# EAGLE design basic-lipo-manager (EAGLE 7.7.0)
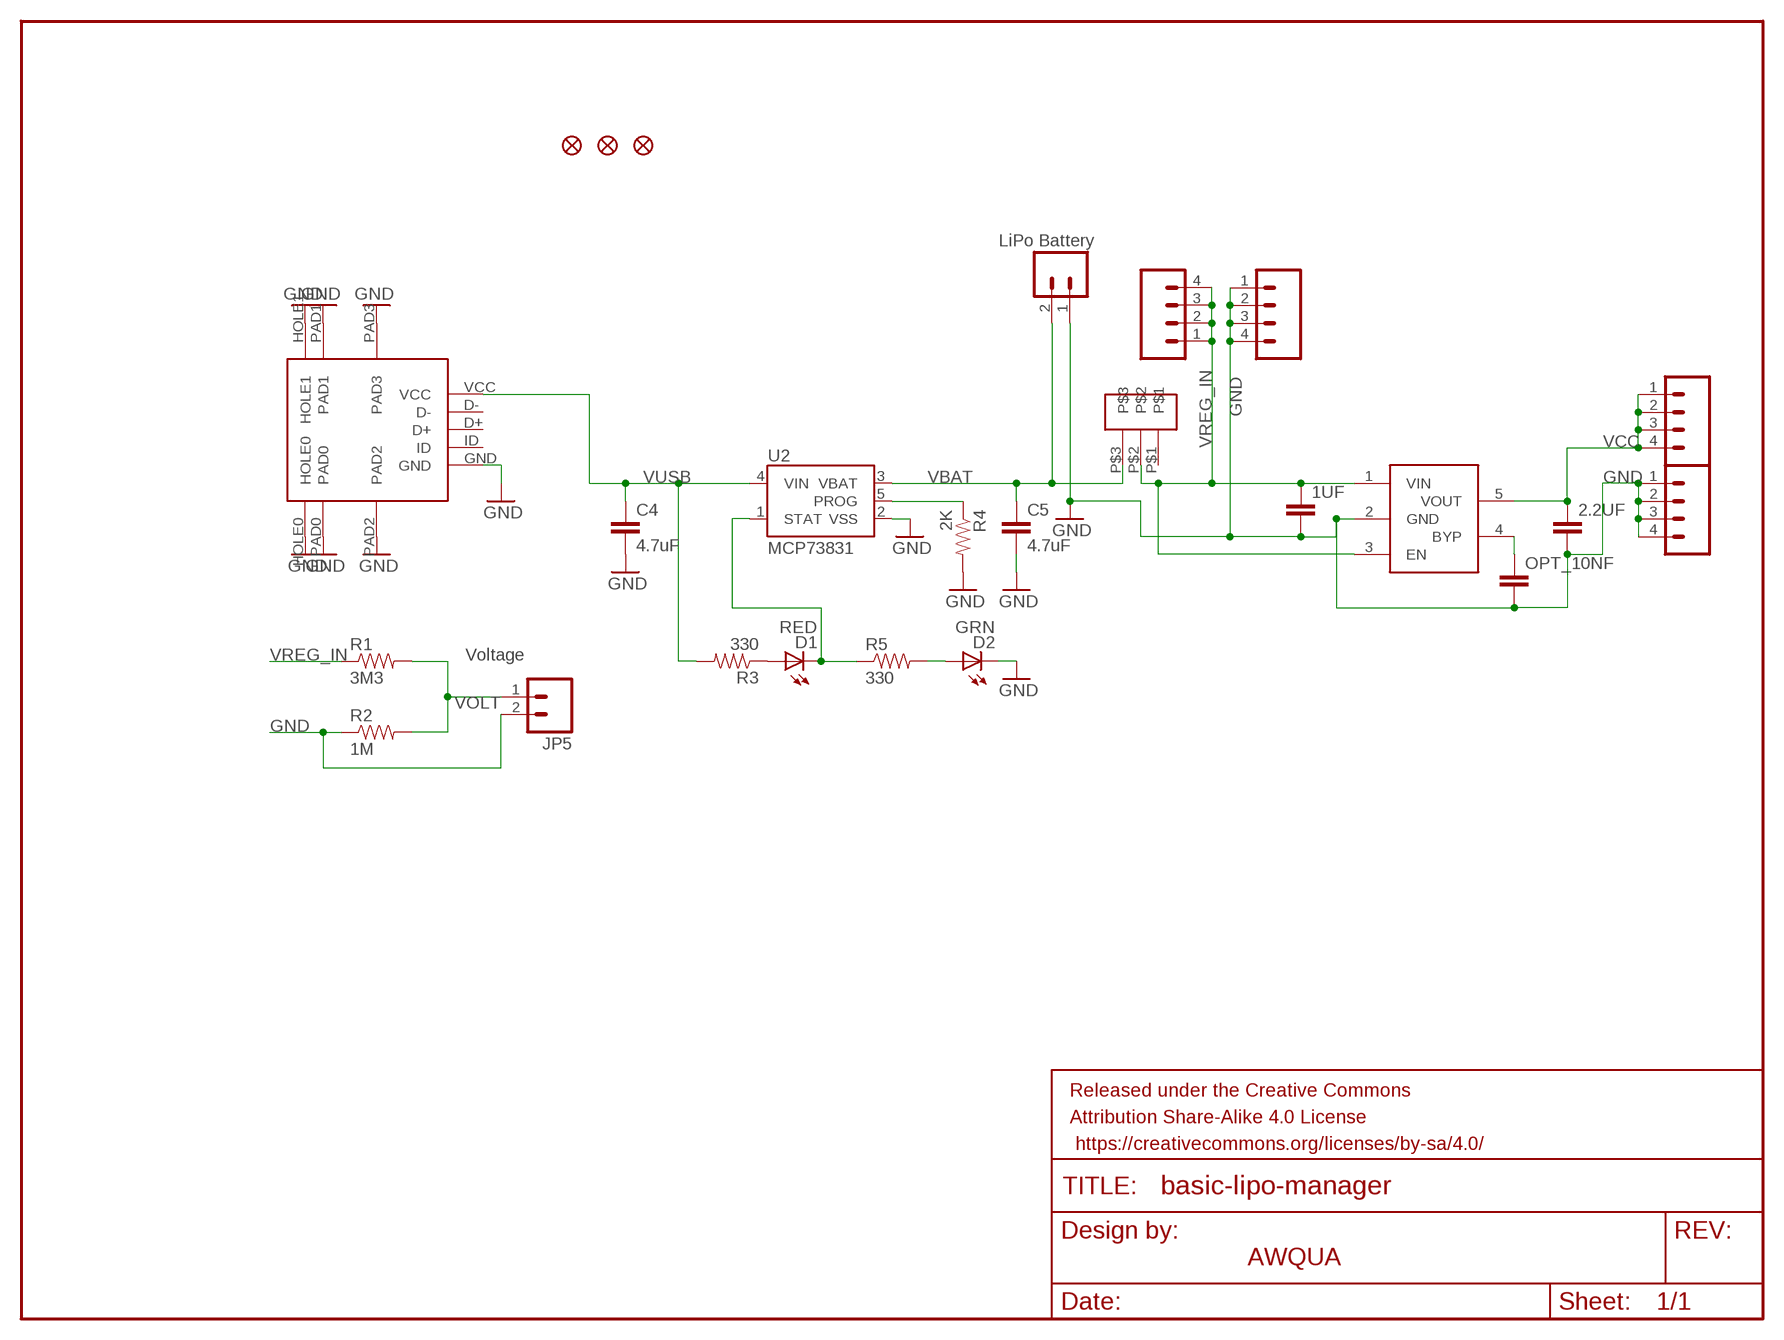
[diagram p0: schematic, sheet 1]

## Parts
1UF  CAP0603-CAP  [0603-CAP]
2.2UF  CAP0603-CAP  [0603-CAP]
C4  4.7uF  CAP0402-CAP  [0402-CAP]
C5  4.7uF  CAP0402-CAP  [0402-CAP]
D1  RED  LED0603  [LED-0603]
D2  GRN  LED0603  [LED-0603]
FID1  FIDUCIAL1X2  [FIDUCIAL-1X2]
FID2  FIDUCIAL1X2  [FIDUCIAL-1X2]
FID3  FIDUCIAL1X2  [FIDUCIAL-1X2]
FRAME1  FRAME-LETTER  [CREATIVE_COMMONS]
JP1  M04PTH  [1X04]
JP2  M04PTH  [1X04]
JP3  M04PTH  [1X04]
JP4  M04PTH  [1X04]
JP5  M02PTH  [1X02]
JP7  LiPo Battery  M02-JST-2MM-SMT  [JST-2-SMD]
OPT_10NF  CAP0603-CAP  [0603-CAP]
R1  3M3  RESISTOR0603  [0603-RES]
R2  1M  RESISTOR0603  [0603-RES]
R3  330  RESISTOR0402-RES  [0402-RES]
R4  2K  RESISTOR0402-RES  [0402-RES]
R5  330  RESISTOR0402-RES  [0402-RES]
U2  MCP73831  [SOT23-5]
U$3  USBMICRO-10118193-0001LF  [USBMICRO-10118193-0001LF]
U$6  LP2985  [LP2985]
U$7  OS102-SPDT-SWITCH  [OS102-SPDT-SWITCH]

## Nets
BYPASS: OPT_10NF.1 U$6.4(BYP)
GND: 1UF.2 2.2UF.2 C4.2 C5.2 D2.C JP2.1 JP2.2 JP2.3 JP2.4 JP4.1 JP4.2 JP4.3 JP4.4 JP5.2 JP7.1 OPT_10NF.2 R2.1 R4.2 U2.2(VSS) U$3.GND U$3.HOLE0 U$3.HOLE1 U$3.PAD0 U$3.PAD1 U$3.PAD2 U$3.PAD3 U$6.2(GND)
N$1: D1.A R3.1
N$5: D2.A R5.2
PROG: R4.1 U2.5(PROG)
STAT: D1.C R5.1 U2.1(STAT)
VBAT: C5.1 JP7.2 U2.3(VBAT) U$7.P$3
VCC: 2.2UF.1 JP3.1 JP3.2 JP3.3 JP3.4 U$6.5(VOUT)
VOLT: JP5.1 R1.2 R2.2
VREG_IN: 1UF.1 JP1.1 JP1.2 JP1.3 JP1.4 R1.1 U$6.1(VIN) U$6.3(EN) U$7.P$2
VUSB: C4.1 R3.2 U2.4(VIN) U$3.VCC
Unconnected: U$3.D+ U$3.D- U$3.ID U$7.P$1

## Notes on the sheet
- Voltage
- AWQUA

## Library data of the parts
1UF 2.2UF OPT_10NF = SparkFun-Passives:CAP: Capacitor Standard 0603 ceramic capacitor, and 0.1" leaded capacitor.
C4 C5 = SparkFun:CAP: Capacitor Standard 0603 ceramic capacitor, and 0.1" leaded capacitor.
D1 D2 = SparkFun:LED: LEDs Standard schematic elements and footprints for 5mm, 3mm, 1206, and 0603 sized LEDs. 5mm - Spark Fun Electronics SKU : COM-00529 (and others)
FID1-FID3 = SparkFun-Aesthetics:FIDUCIAL: Fiducial Alignment Points Various fiducial points for machine vision alignment.
FRAME1 = SparkFun-Aesthetics:FRAME-LETTER: Schematic Frame Standard 8.5x11 US Letter frame
JP1-JP4 = SparkFun-Connectors:M04: Header 4 Standard 4-pin 0.1" header. Use with straight break away headers (SKU : PRT-00116), right angle break away headers (PRT-00553), swiss pins (PRT-00743), machine pins (PRT-00117), and female headers (PRT-00115). Molex polarized connector foot print use with SKU : PRT-08231 with associated crimp pins and housings. 1MM SMD Version SKU: PRT-10208
JP5 = SparkFun-Connectors:M02: Standard 2-pin 0.1" header. Use with - straight break away headers ( PRT-00116) - right angle break away headers (PRT-00553) - swiss pins (PRT-00743) - machine pins (PRT-00117) - female headers (PRT-00115) Molex polarized connector foot print use with: PRT-08233 with associated crimp pins and housings. 2.54_SCREWTERM for use with PRT-10571. 3.5mm Screw Terminal footprints for PRT-08084 5mm Screw Terminal footprints for use with PRT-08432
JP7 = SparkFun:M02: Header 2 Standard 2-pin 0.1" header. Use with straight break away headers (SKU : PRT-00116), right angle break away headers (PRT-00553), swiss pins (PRT-00743), machine pins (PRT-00117), and female headers (PRT-00115). Molex polarized connector foot print use with SKU : PRT-08233 with associated crimp pins and housings.
R1 R2 = SparkFun-Resistors:RESISTOR: Resistor Basic schematic elements and footprints for 0603, 1206, and PTH resistors.
R3-R5 = SparkFun:RESISTOR: Resistor Basic schematic elements and footprints for 0603, 1206, and PTH resistors.
U2 = SparkFun:MCP73831: Microchip's MCP73831 Miniature single cell, fully integrated Li-Ion, Li-polymer charge management controller http://ww1.microchip.com/downloads/en/DeviceDoc/21984a.pdf
U$3 = awqua_eagle_library:USBMICRO-10118193-0001LF
U$6 = awqua_eagle_library:LP2985
U$7 = awqua_eagle_library:OS102-SPDT-SWITCH

## Board
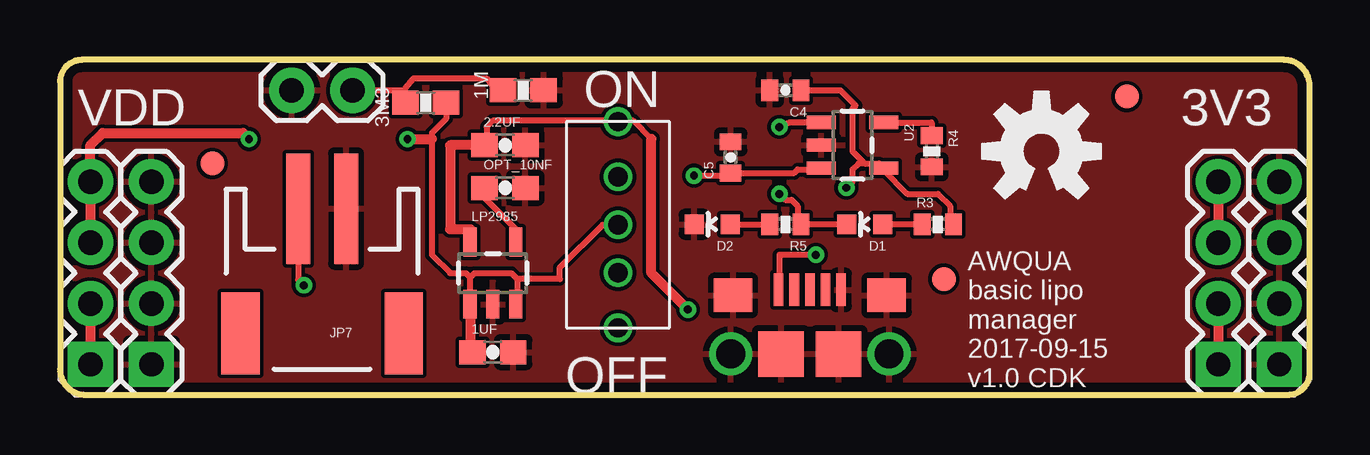
[diagram p1: board, top side]
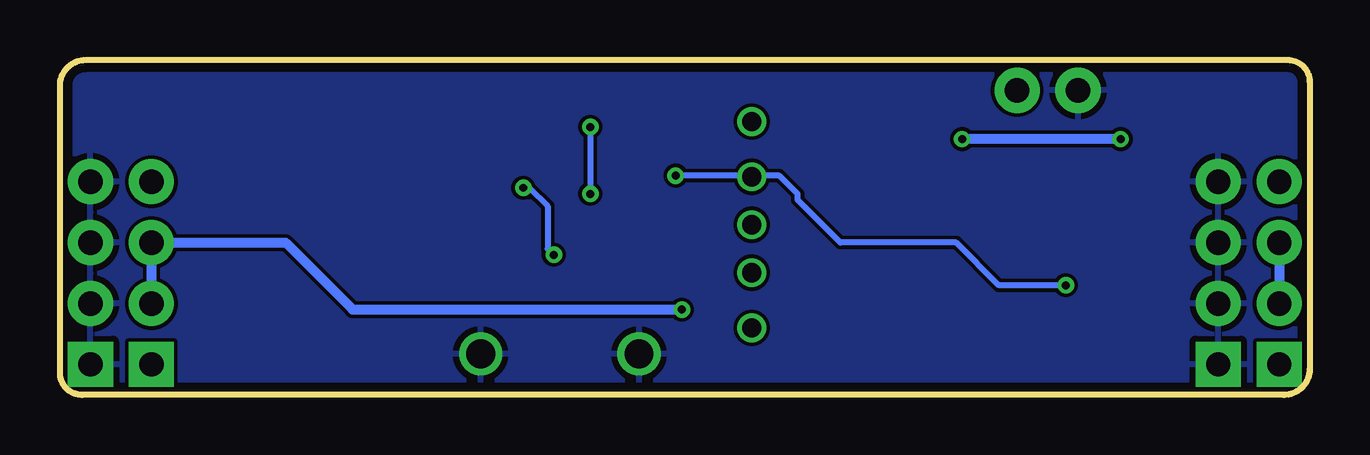
[diagram p2: board, bottom side, seen from below]

Size 52.07 x 13.97 mm. Coordinates in mm from the lower left corner, seen from the top.
Outline: 0,13.05 0,1.08 arc90 1.08,0 51.15,0 arc90 52.07,0.92 52.07,12.89 arc90 50.99,13.97 0.92,13.97 arc90 0,13.05
Copper layers (1*16): Top 0.0356mm / dielectric 1.5011mm / Bottom 0.0356mm
Design rules "default *": minimum track width 6mil, minimum drill 13mil, track to track 6mil, track to pad 6mil, pad to pad 6mil, via to via 6mil, smd to smd 6mil, copper to edge 15mil, drill to drill 6mil, minimum pad ring 7mil, minimum via ring 7mil, stop-mask expansion 4mil, vias tented up to drill 15mil, thermal gap 10mil

### Footprints (pad centres in the part's own frame; a part is rotated, then mirrored left to right if it is on the bottom)
0603-CAP = smd 1.1 x 1: 1 -0.85,0; 2 0.85,0
0402-CAP = smd 0.7 x 0.9: 1 -0.65,0; 2 0.65,0
LED-0603 = smd 0.8 x 0.8: A 0,-0.75; C 0,0.75
FIDUCIAL-1X2 = smd 1 x 1: 1 0,0
1X04 = drill 1.016 pad 1.88 square: 1 0,0 | drill 1.016 pad 1.88: 2 2.54,0; 3 5.08,0; 4 7.62,0
1X02 = drill 1.016 pad 1.88: 1 0,0; 2 2.54,0
JST-2-SMD = smd 1 x 4.6: 1 -1,-3.7; 2 1,-3.7 | smd 1.6 x 3.4: NC1 -3.4,1.5; NC2 3.4,1.5
0603-RES = smd 1.1 x 1: 1 -0.85,0; 2 0.85,0
0402-RES = smd 0.7 x 0.9: 1 -0.65,0; 2 0.65,0
SOT23-5 = smd 0.55 x 1.2: 1 -0.95,-1.3; 2 0,-1.3; 3 0.95,-1.3; 4 0.95,1.3; 5 -0.95,1.3
USBMICRO-10118193-0001LF = smd 0.4 x 1.35: D+ 0,4.125; D- -0.65,4.125; GND 1.3,4.125; ID 0.65,4.125; VCC -1.3,4.125 | drill 1.2 pad 1.6: HOLE0 3.3,1.45; HOLE1 -3.3,1.45 | smd 1.9 x 1.9: PAD0 1.2,1.45; PAD1 -1.2,1.45 | smd 1.6 x 1.4: PAD2 3.2,3.9; PAD3 -3.2,3.9
LP2985 = smd 0.55 x 1.2: 1 0.32,-0.03; 2 1.27,-0.03; 3 2.22,-0.03; 4 2.22,2.57; 5 0.32,2.57
OS102-SPDT-SWITCH = drill 0.8: ANCHOR1 0,2.15; ANCHOR2 8.6,2.15; P$1 2.3,2.15; P$2 4.3,2.15; P$3 6.3,2.15

### Placement (x,y rotation side)
1UF  18.03,1.78 0 top
2.2UF  18.54,10.41 0 top
C4  30.23,12.7 180 top
C5  27.94,9.91 90 top
D1  33.53,7.11 90 top
D2  27.18,7.11 90 top
FID1  6.35,9.65 0 top
FID2  36.83,4.83 0 top
FID3  44.45,12.45 0 top
FRAME1  -0.64,-8.89 0 top  (outside the outline)
JP1  1.27,1.27 90 top
JP2  3.81,1.27 90 top
JP3  48.26,1.27 90 top
JP4  50.8,1.27 90 top
JP5  12.19,12.7 180 top
JP7  10.92,4.06 180 top
OPT_10NF  18.54,8.64 0 top
R1  15.24,12.19 180 top
R2  19.3,12.7 180 top
R3  36.58,7.11 0 top
R4  36.32,10.16 270 top
R5  30.23,7.11 180 top
U2  33.02,10.41 270 top
U$3  31.24,0.25 0 top
U$4  [OSHW-LOGO-M]  40.89,10.16 0 top
U$6  16.76,3.81 0 top
U$7  25.4,2.79 90 top

### Tracks (layer width: path | path; a pad name or v marks a point on that pad's centre or on a via)
BYPASS
  Top 0.254: OPT_10NF.1 17.69,8.22 19.05,6.86 19.05,6.45 U$6.4
GND
  pour Top: 65.28,-5.84 -4.57,-3.3 -4.06,19.3 65.28,16.51
  pour Bottom: -2.79,19.56 64.52,20.32 64.01,-6.6 -2.79,-7.37
N$1
  Top 0.254: R3.1 D1.A
N$5
  Top 0.254: D2.A R5.2
PROG
  Top 0.254: U2.5 36.32,11.36 R4.1
STAT  (via drill 0.33)
  Top 0.254: D1.C R5.1 30.73,7.25 30.73,7.87 30.48,8.13 30.23,8.13 v29.97,8.38 | U2.1 30.41,11.36 v29.97,11.18
  Bottom 0.254: v29.97,11.18 v29.97,8.38
VBAT  (via drill 0.33)
  Top 0.254: U2.3 31.65,9.4 30.73,9.4 30.59,9.26 C5.1 27.43,9.14 v26.42,9.14 | JP7.2 9.92,4.81 v10.16,4.57
  Bottom 0.254: v26.42,9.14 22.91,9.14 U$7.P$3 22.69,9.14 22.1,9.14 21.34,8.38 21.34,8.13 19.56,6.35 14.73,6.35 12.95,4.57 v10.16,4.57
VCC  (via drill 0.33)
  Top 0.254: 24.64,10.67 23.88,11.43 18.03,11.43 17.78,11.18 17.78,10.5 2.2UF.1
  Top 0.406: 2.2UF.1 16.26,10.41 16.26,6.91 17.11,6.91 17.11,6.4 U$6.5 | v26.16,3.56 24.64,5.08 24.64,10.67 | JP3.4 JP3.3 | JP3.2 JP3.1
  Bottom 0.406: v26.16,3.56 39.88,3.56 42.67,6.35 JP3.3 JP3.2
VOLT
  Top 0.254: JP5.1 14.22,12.7 R1.2 14.39,12.79 14.73,13.21 17.78,13.21 18.29,12.53 R2.2
VREG_IN  (via drill 0.33)
  Top 0.254: U$6.1 17.08,4.89 | 17.08,4.89 17.27,5.08 18.8,5.08 19.05,4.83 | 19.05,4.83 19.05,3.85 U$6.3 | 19.05,4.83 20.83,4.83 20.83,5.32 22.61,7.09 U$7.P$2 | R1.1 16.09,11.52 15.49,10.92 15.49,10.67 15.49,5.84 16.26,5.08 16.9,5.08 17.08,4.89
  Top 0.406: v7.87,10.67 7.62,10.92 1.78,10.92 1.27,10.41 JP1.4 JP1.3 | v14.48,10.67 15.49,10.67 | JP1.2 JP1.1 | U$6.1 17.08,1.88 1UF.1
  Bottom 0.406: v7.87,10.67 v14.48,10.67 | JP1.3 JP1.2
VUSB  (via drill 0.33)
  Top 0.254: 33.53,9.65 33.02,10.16 33.02,11.94 33.15,12.06 32.51,12.7 C4.1 | 33.53,9.65 34.13,9.65 U2.4 34.32,9.37 35.31,8.38 36.58,8.38 37.08,7.87 37.08,7.25 R3.2 | 33.53,9.65 33.27,9.65 33.02,9.4 33.02,8.89 v32.77,8.64 | v31.5,5.84 29.97,5.84 29.97,4.41 U$3.VCC
  Bottom 0.254: v32.77,8.64 32.51,8.64 31.75,7.87 31.75,6.1 v31.5,5.84

### Text on the board
tPlace: ON | VDD | 3V3 | OFF | AWQUA / basic lipo / manager / 2017-09-15 / v1.0 CDK
tNames: AWQUA